# EAGLE design RemoteBoard (EAGLE 9.4.2)
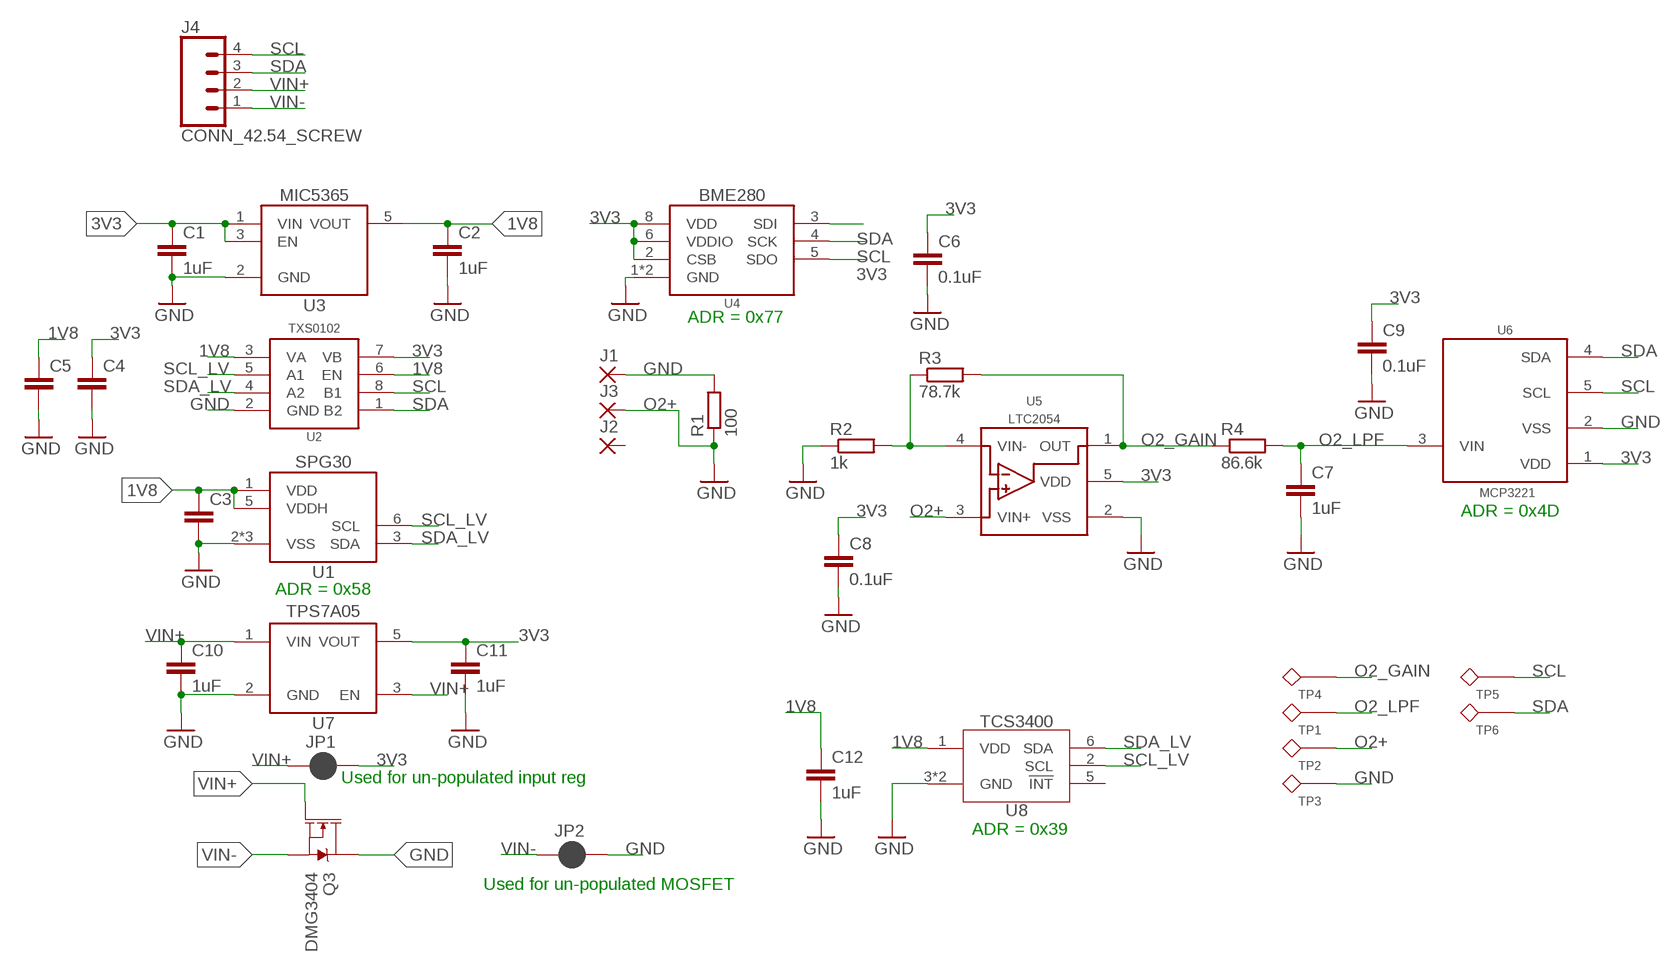
[diagram p0: schematic, sheet 1]

## Parts
C1  1uF  C-EUC0805  [C0805]
C2  1uF  C-EUC0805  [C0805]
C3  C-EUC0805  [C0805]
C4  C-EUC0805  [C0805]
C5  C-EUC0805  [C0805]
C6  0.1uF  C-EUC0805  [C0805]
C7  1uF  C-EUC0805  [C0805]
C8  0.1uF  C-EUC0805  [C0805]
C9  0.1uF  C-EUC0805  [C0805]
C10  1uF  C-EUC0805  [C0805]
C11  1uF  C-EUC0805  [C0805]
C12  1uF  C-EUC0805  [C0805]
J1  SOCKETS9111_SLOT  [SOCKET_S9111-45R_SLOT]
J2  SOCKETS9111_SLOT  [SOCKET_S9111-45R_SLOT]
J3  SOCKETS9111_SLOT  [SOCKET_S9111-45R_SLOT]
J4  CONN_42.54_SCREW  [1X04_SCREW]
JP1  JUMPER-SMT_2_NC_PASTE_SILK  [SMT-JUMPER_2_NC_PASTE_SILK]
JP2  JUMPER-SMT_2_NC_PASTE_SILK  [SMT-JUMPER_2_NC_PASTE_SILK]
Q3  DMG3404  MOSFET-NCH-DMG3404L  [SOT23-3]
R1  100  R-EU_R0805  [R0805]
R2  1k  R-EU_R0805  [R0805]
R3  78.7k  R-EU_R0805  [R0805]
R4  86.6k  R-EU_R0805  [R0805]
TP1  TESTPOINTRCU  [TESTPOINT_0603]
TP2  TESTPOINTRCU  [TESTPOINT_0603]
TP3  TESTPOINTRCU  [TESTPOINT_0603]
TP4  TESTPOINTRCU  [TESTPOINT_0603]
TP5  TESTPOINTRCU  [TESTPOINT_0603]
TP6  TESTPOINTRCU  [TESTPOINT_0603]
U1  SPG30  [DFN_6_2.5X2.5]
U2  TXS0102DCU  [DCU_(R-PDSO-G8)]
U3  MIC53651.8SC70  [DCK_R-PDSO-G5]
U4  BME280  [BME280]
U5  LTC2054  [SOT23-5]
U6  MCP3221  [SOT23-5]
U7  TPS7A0533DBV  [SOT23-5]
U8  TCS3400  [TCS3400]

## Nets
1V8: C2.1 C3.1 C5.1 C12.1 U1.1(VDD) U1.5(VDDH) U2.3(VA) U2.6(EN) U3.5(VOUT) U8.1(VDD)
3V3: C1.1 C4.1 C6.1 C8.1 C9.1 C11.1 JP1.2 U2.7(VB) U3.1(VIN) U3.3(EN) U4.2(CSB) U4.5(SDO) U4.6(VDDIO) U4.8(VDD) U5.5(VDD) U6.1(VDD) U7.5(VOUT)
GND: C1.2 C2.2 C3.2 C4.2 C5.2 C6.2 C7.2 C8.2 C9.2 C10.2 C11.2 C12.2 J1.PAD(P) JP2.2 Q3.3(D) R1.2 R2.1 TP3.1 U1.2(VSS) U1.4(VSS) U1.EP(VSS) U2.2(GND) U3.2(GND) U4.1(GND) U4.7(GND) U5.2(VSS) U6.2(VSS) U7.2(GND) U8.3(GND) U8.4(GND)
N$1: R2.2 R3.1 U5.4(VIN-)
O2+: J3.PAD(P) R1.1 TP2.1 U5.3(VIN+) ; supply symbol labelled GND
O2_GAIN: R3.2 R4.1 TP4.1 U5.1(OUT)
O2_LPF: C7.1 R4.2 TP1.1 U6.3(VIN)
SCL: J4.4 TP5.1 U2.8(B1) U4.4(SCK) U6.5(SCL)
SCL_LV: U1.6(SCL) U2.5(A1) U8.2(SCL)
SDA: J4.3 TP6.1 U2.1(B2) U4.3(SDI) U6.4(SDA)
SDA_LV: U1.3(SDA) U2.4(A2) U8.6(SDA)
VIN+: C10.1 J4.2 JP1.1 Q3.1(G) U7.1(VIN) U7.3(EN)
VIN-: J4.1 JP2.1 Q3.2(S)
Unconnected: J2.PAD(P) U8.5(!INT)

## Notes on the sheet
- ADR = 0x77
- ADR = 0x4D
- ADR = 0x58
- Used for un-populated input reg
- ADR = 0x39
- Used for un-populated MOSFET

## Library data of the parts
C1-C8 = bschulz:C-EU: CAPACITOR, European symbol
C9-C12 = bschulz_passives:C-EU: CAPACITOR, European symbol
J1-J3 = bschulz:SOCKET: Generic Board Socket
J4 = bschulz:CONN_4: Genaric 4 terminal header Digikey 2.54_SCREW <https://www.digikey.com/product-detail/en/on-shore-technology-inc/OSTVN04A150/ED10563-ND/1588864>; DIGIKEY: ED10563-ND; MF: On Shore; MPN: OSTVN04A150
JP1 JP2 = SparkFun-Jumpers:JUMPER-SMT_2_NC_PASTE: Normally closed solder jumper This jumper has an aperture in the stencil to allow solder paste to bridge the split in the wire so it's normally closed (NC). Wick off the solder to open the connection. Reapply solder to reclose the connection.
Q3 = bschulz:MOSFET-NCH: N-channel MOSFETs Voltage controlled devices that allow control of high current outputs. SparkFun Products: SparkFun OpenScale <https://www.sparkfun.com/products/13261> SparkFun Digital Sandbox <https://www.sparkfun.com/products/12651> SparkFun Monster Moto Shield <https://www.sparkfun.com/products/10182> SparkFun MOSFET Power Controller <https://www.sparkfun.com/products/11214>; DIGIKEY: DMG3404L-7DICT-ND; MF: Diodes Incorporated; MPN: DMG3404L-7
R1-R4 = bschulz_passives:R-EU_: RESISTOR, European symbol Digikey Parts: Yageo, 0402 <https://www.digikey.com/products/en/resistors/chip-resistor-surface-mount/52?k=&pkeyword=&sf=0&FV=ffec1104%2Cfffc000d%2C1c0002%2C440067%2C1f140000%2Cffe00034%2C400004&quantity=&ColumnSort=0&page=1&stock=1&pageSize=25> Yageo, 0603 <https://www.digikey.com/products/en/resistors/chip-resistor-surface-mount/52?k=&pkeyword=&s=4356&s=47360&sf=0&FV=fffc000d%2C1c0002%2C142c040c%2C1f140000%2Cffe00034&quantity=10&ColumnSort=1000011&page=1&stock=1&pageSize=25> Panasonic, 0603 <https://www.digikey.com/products/en/resistors/chip-resistor-surface-mount/52?k=&pkeyword=&pv252=68&sf=0&FV=ffec373d%2C1c0002%2C142c040c%2C1f140000%2Cffe00034%2C80002%2Cc0001&quantity=&ColumnSort=0&page=1&stock=1&pageSize=25> Panasonic, precision, 0603 <https://www.digikey.com/products/en/resistors/chip-resistor-surface-mount/52?FV=ffec4907%2Cfffc000a%2Cc0172%2C142c040c%2C1f140000%2Cffe00034%2C1c0002&quantity=100&ColumnSort=2085&page=1&stock=1&pageSize=25> Panasonic, 0805 <https://www.digikey.com/products/en/resistors/chip-resistor-surface-mount/52?k=&pkeyword=&pv3=1&sf=0&FV=ffec373d%2C1c0002%2C1f140000%2Cffe00034%2C142c040d&quantity=&ColumnSort=0&page=1&stock=1&pageSize=25> Rohm, current sense <https://www.digikey.com/products/en/resistors/chip-resistor-surface-mount/52?k=&pkeyword=&pv3=1&sf=0&FV=ffecb688%2C1f140000%2Cffe00034%2C1c0002&quantity=&ColumnSort=0&page=1&stock=1&pageSize=25> Vishay, pulse proof automotive <https://www.digikey.com/products/en/resistors/chip-resistor-surface-mount/52?k=&pkeyword=&pv7=2&sf=0&FV=ffec5d6b%2Cffe00034%2C1f140000&quantity=&ColumnSort=0&page=1&stock=1&pageSize=25>
TP1-TP6 = bschulz:TESTPOINT; DIGIKEY: A106145CT-ND; MF: TE Connectivity; MPN: RCU-0C
U1 = bschulz:SPG30: SGP30 - Multi-pixel Gas Sensor (TVOC, CO2EQ) Characteristics: Vcc: 1.8V Gas Sensing: Ethanol, H2, TVOC, CO2eq Sample Rate: 1Hz (Air Quality), 40Hz (Gas) Operating Temperature: -40°C to 85°C Digikey: 1649-1084-1-ND <https://www.digikey.com/product-detail/en/sensirion-ag/SGP30-2.5K/1649-1084-1-ND/7400967>; DIGIKEY: 1649-1084-1-ND; MF: Sensirion; MPN: SGP30-2.5K
U2 = bschulz:TXS0102: TXS0102 - 2 Channel Bidirectional Voltage Level Translator Characteristics: Vcc: 1.65 ~ 3.6V (Port A), 2.3 ~ 5.5V (Port B) IQ: 14.4μA Output Current: 50mA Output Type: Open Drain/Push-Pull Operating Temperature: -40°C to 85°C Digikey: 296-28368-1-ND (DQE) <https://www.digikey.com/product-detail/en/texas-instruments/TXS0102DQER/296-28368-1-ND/2625893> 296-28435-1-ND (DQM) <https://www.digikey.com/product-detail/en/texas-instruments/TXS0102DQMR/296-28435-1-ND/2638910> 296-21931-1-ND (DCU) <https://www.digikey.com/product-detail/en/texas-instruments/TXS0102DCUR/296-21931-1-ND/1629284>; DIGIKEY: 296-21931-1-ND; MF: TI; MPN: TXS0102DCUR
U3 = bschulz:MIC5365: MIC5365-* - Low Power, High Performance, Linear Regulator Characteristics: Vin: 2.5V ~ 5.5V Vout: Many options, (1v ~ 3.3v) see datasheet <http://ww1.microchip.com/downloads/en/DeviceDoc/mic5365.pdf> IQ: 29μA typ Dropout Voltage: 55mV @ 50mA, input ≥ 2.8v Voltage Accuracy: 2% typ Output Current: 150 mA Operating Temperature: -40°C to 125°C Mouser: MIC5365-3.3YC5 (3.3V Fixed) <https://www.digikey.com/product-detail/en/microchip-technology/MIC5365-3.3YC5-TR/576-3193-1-ND/1868230> MIC5365-1.8YC5 (1.8V Fixed) <https://www.digikey.com/products/en/integrated-circuits-ics/pmic-voltage-regulators-linear/699?k=mic5365&k=&pkeyword=mic5365&sv=0&pv1291=881&sf=0&FV=1c0002%2C1f140000%2Cffe002bb%2C1bcc0020&quantity=&ColumnSort=0&page=1&stock=1&pageSize=25>; DIGIKEY: 576-3181-1-ND; MF: Microchip; MPN: MIC5365-1.8YC5-TR
U4 = bschulz:BME280: BME280 - Combined Digital Humidity and Pressure Sensor Characteristics: Vcc: 1.8V ~ 3.3V Pressure Range: 300 ~ 1100 mBar Pressure Resolution: 0.0015 mBar, max Pressure Accuracy: relative ±0.12 mBar, abs ± 1 mBar Humidity Resolution: 0.008% RH, max Humidity Accuracy: ±3% RH Temperature Resolution: 0.01°C Temperature Accuracy: 0.5°C Operating Temperature: -40°C to 85°C Digikey: 828-1063-1-ND <https://www.digikey.com/product-detail/en/bosch-sensortec/BME280/828-1063-1-ND/6136314>; DIGIKEY: 828-1063-1-ND; DISP: BME280; MF: Bosch; MPN: BME280
U5 = bschulz:LTC2054: LTC2054 -Single Micropower Zero Drift Op-Amp Characteristics: Vs: 2.7 ~ 6V (2.7 ~ +/- 5.5V for LTC2054HV) Iq: 175uA GBP: 500kHz PSSR: 130dB CMMR: 130dB Operating Temperature: -40°C to 85°C Digikey: LTC2054CS5#TRPBFCT-ND <https://www.digikey.com/scripts/DkSearch/dksus.dll?Detail&itemSeq=258611552&uq=636603257096973101> LTC2054HVIS5#TRMPBFCT-ND (High Voltage Variant) <https://www.digikey.com/product-detail/en/linear-technology-analog-devices/LTC2054HVIS5-TRMPBF/LTC2054HVIS5-TRMPBFCT-ND/3830416>; DIGIKEY: LTC2054HS5#TRMPBFCT-ND; DISP: LTC2054; MF: LT; MPN: LTC2054HS5#TRMPBF
U6 = bschulz:MCP3221: MCP342* - SAR ADC Characteristics: VCC: 2.7~5.5V Operating Temperature: -40°C to 125°C Number of Inputs: 1 Sample Rate: 22.3k Samples Per Second Number of Bits: 12 Digikey: MCP3221A5T-I/OTCT-ND <https://www.digikey.com/product-detail/en/microchip-technology/MCP3221A5T-I-OT/MCP3221A5T-I-OTCT-ND/529836>; DIGIKEY: MCP3221A5T-I/OTCT-ND; DISP: MCP3221; MF: TI; MPN: MCP3221A5T-I/OT
U7 = bschulz:TPS7A05*: TPS7A05* - Ultra Low Power Low Dropout Linear Regulator Characteristics: Vin: 1.4V ~ 5.5V Vout: 0.8, 1.0, 1.2, 1.5, 1.8, 2.5, 2.85, 3.3V fixed IQ: 1μA typ, 3μA max Voltage Accuracy: 1% typ, 3% max Output Current: 200 mA Operating Temperature: -40°C to 125°C Mouser: TPS7A0533 (3.3V Fixed) <https://www.mouser.com/ProductDetail/Texas-Instruments/TPS7A0533PDBVR?qs=sGAEpiMZZMsGz1a6aV8DcD1rpA6FsR3J1Mp5DdTpiXw%3d> TPS7A0518 (1.8V Fixed) <https://www.mouser.com/ProductDetail/Texas-Instruments/TPS7A0518PDBVR?qs=sGAEpiMZZMsGz1a6aV8DcD1rpA6FsR3J1f7DNYacdSI%3d>; DIGIKEY: 296-50256-1-ND; MF: TI; MOUSER: 595-TPS7A0533PDBVR; MPN: TPS7A0533PDBVR
U8 = bschulz:TCS3400: TCS3400 - Ambient Multi-Band Light Sensor with I2C Interface Characteristics: VCC: 2.7~3.6V Operating Temperature: -40°C to 70°C Digikey: TCS34003FNMCT-ND <https://www.digikey.com/products/en/sensors-transducers/optical-sensors-ambient-light-ir-uv-sensors/536?k=tcs3400&k=&pkeyword=tcs3400&sv=0&pv7=2&sf=0&FV=-8%7C536%2C1989%7C0&quantity=&ColumnSort=0&page=1&stock=1&pageSize=25>; DIGIKEY: TCS34003FNMCT-ND; MF: AMS; MPN: TCS34003FNM

## Board
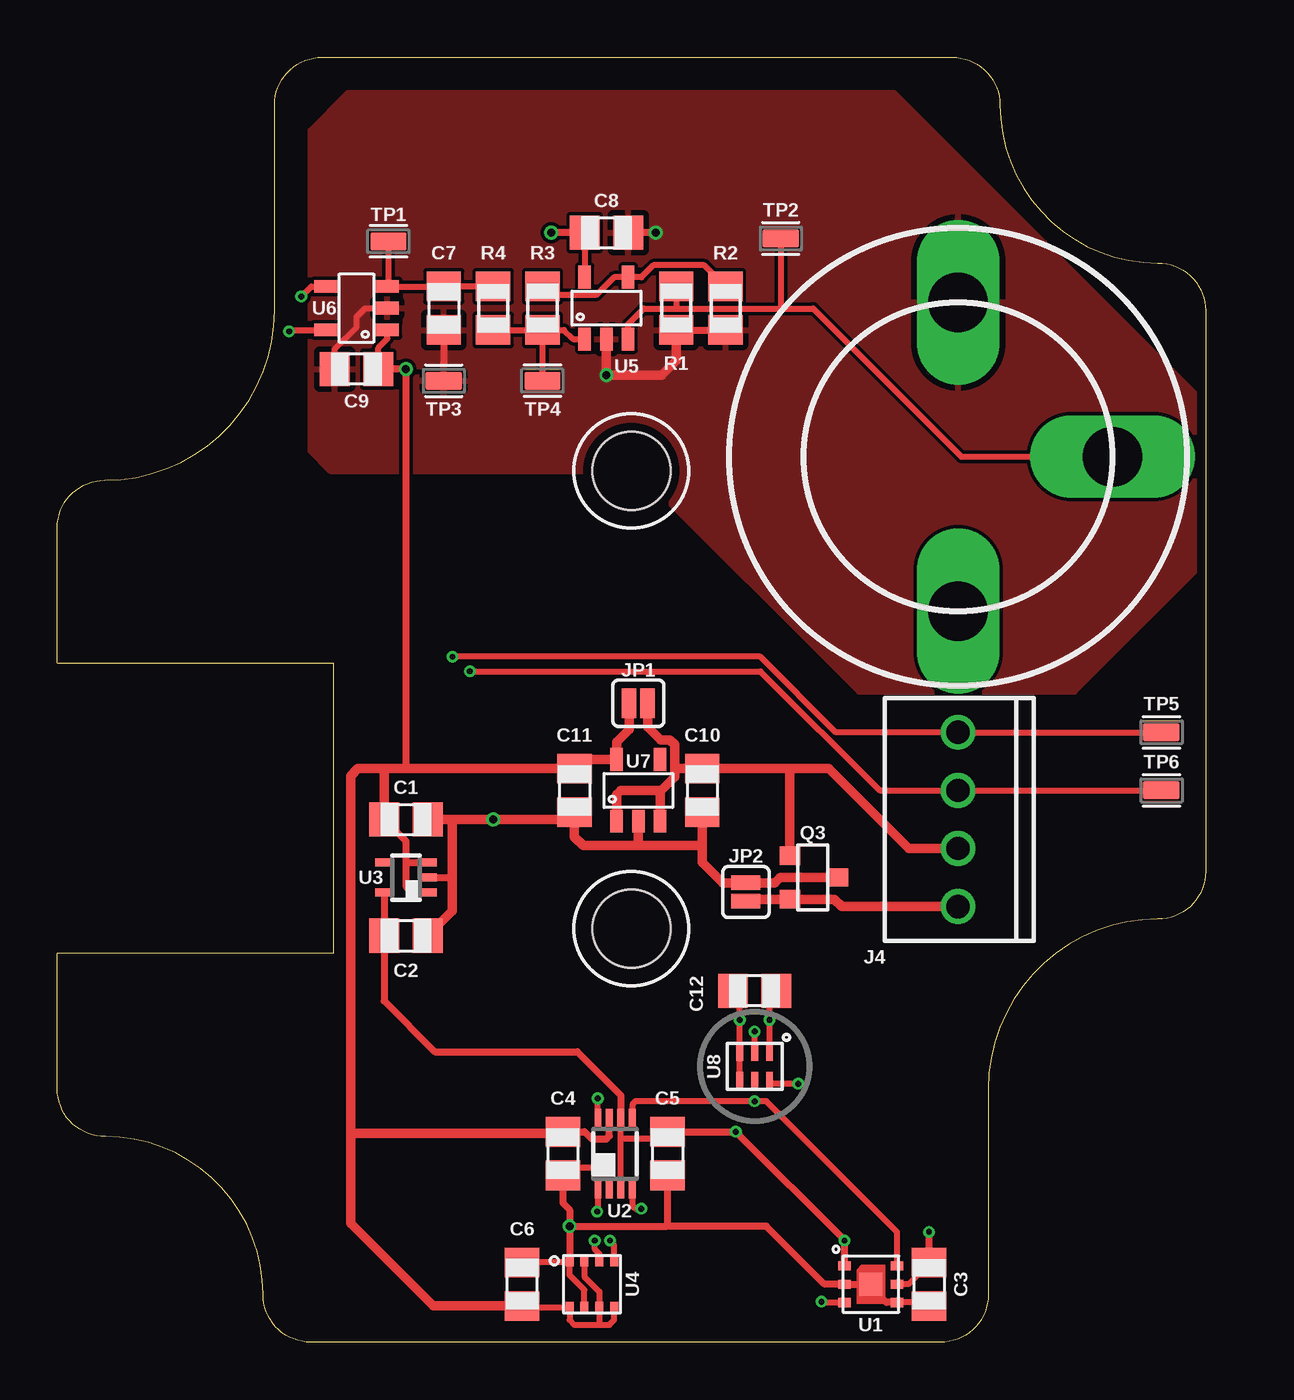
[diagram p1: board, top side]
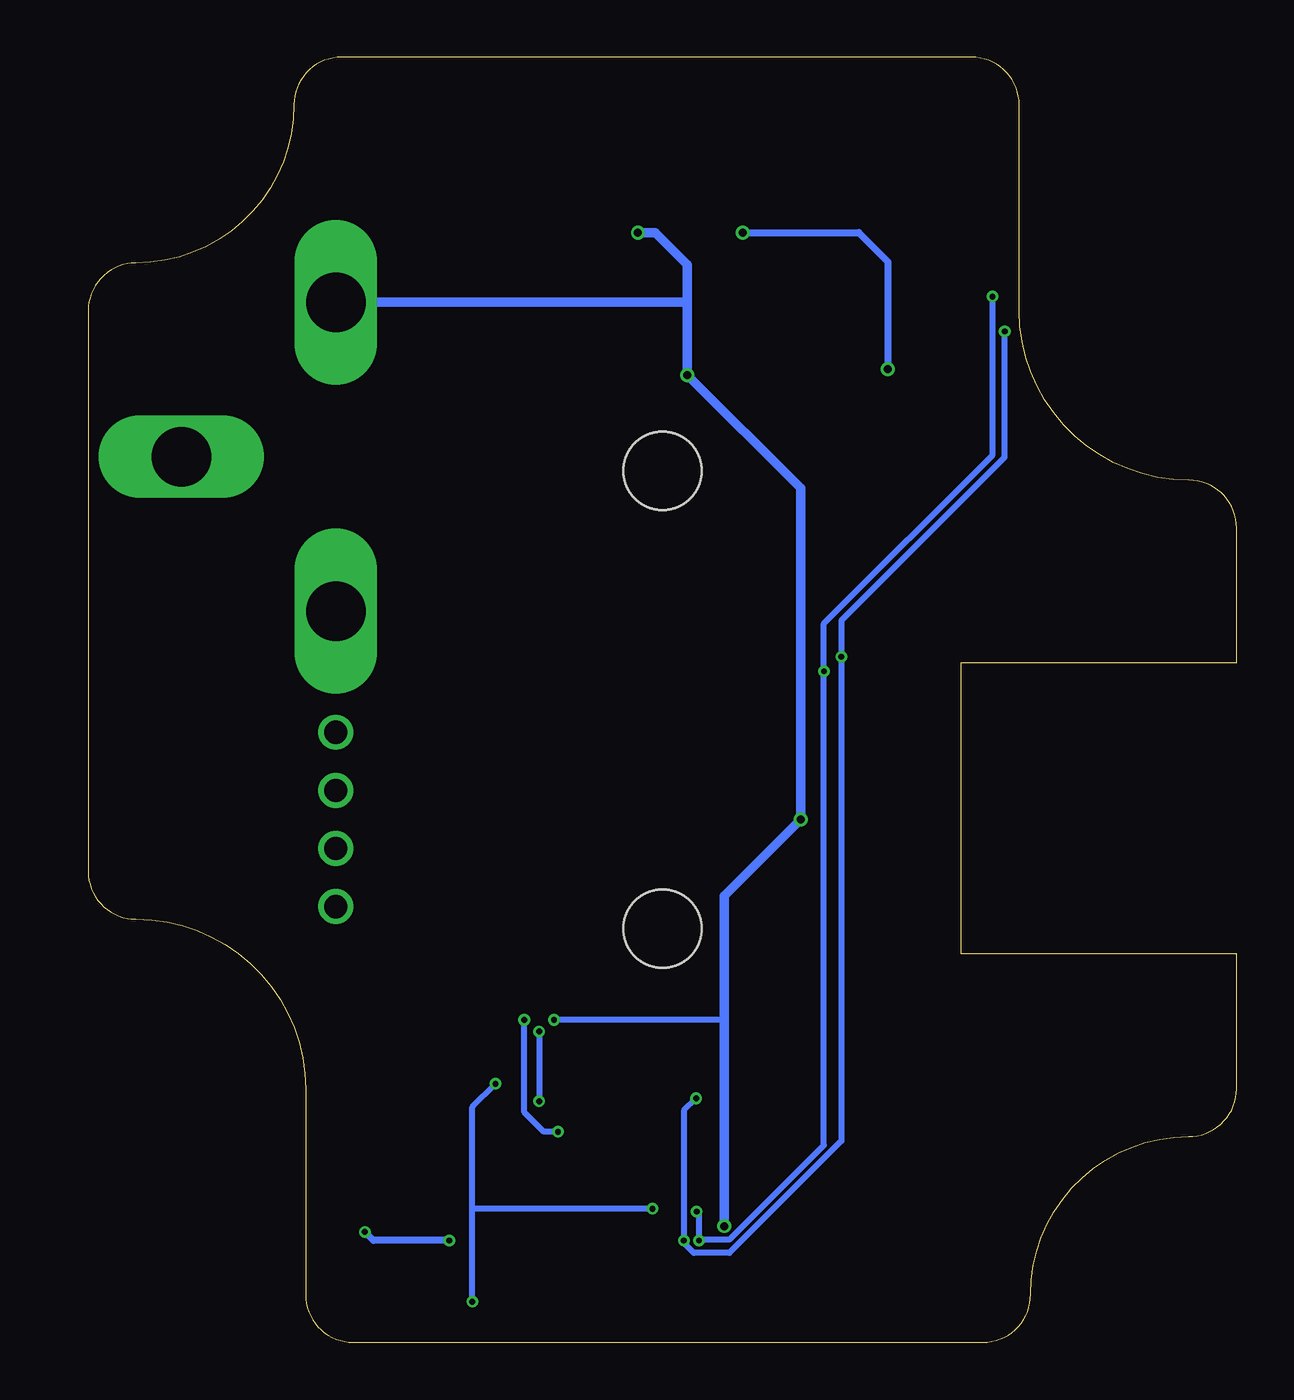
[diagram p2: board, bottom side, seen from below]

Size 50.19 x 56.18 mm. Coordinates in mm from the lower left corner, seen from the top.
Outline: 38.61,0 11.08,0 arc-90 9,2.1 arc90 2.1,9 arc-90 0,11.08 0,16.99 12.06,16.99 12.06,29.69 0,29.69 0,35.61 arc-90 2.08,37.69 arc90 9.5,45.11 9.5,54.1 arc-90 11.58,56.19 39.12,56.19 arc-90 41.2,54.1 arc90 48.11,47.19 arc-90 50.19,45.1 50.19,20.58 arc-90 48.11,18.5 arc90 40.69,11.08 40.69,2.08 arc-90 38.61,0
Copper layers (1*16): Top 0.035559375mm / dielectric 1.6mm / Bottom 0.035559375mm
Design rules "oshpark-2layer *": minimum track width 6mil, minimum drill 10mil, track to track 6mil, track to pad 6mil, pad to pad 6mil, via to via 6mil, smd to smd 6mil, copper to edge 15mil, drill to drill 6mil, minimum pad ring 5mil, minimum via ring 5mil, stop-mask expansion 2.5mil, vias tented up to drill 0mil, thermal gap 10mil
Holes 3.43 mm at 25.1,18.08 25.1,38.1

### Footprints (pad centres in the part's own frame; a part is rotated, then mirrored left to right if it is on the bottom)
C0805 = smd 1.3 x 1.5: 1 -0.95,0; 2 0.95,0
SOCKET_S9111-45R_SLOT = drill 2.6 pad 3 long: PAD 0,0
1X04_SCREW = drill 1.016: 1 -3.81,0; 2 -1.27,0; 3 1.27,0; 4 3.81,0
SMT-JUMPER_2_NC_PASTE_SILK = smd 0.635 x 1.27: 1 -0.406,0; 2 0.406,0
SOT23-3 = smd 0.8 x 0.9: 1 -0.95,-1; 2 0.95,-1; 3 0,1.1
R0805 = smd 1.3 x 1.5: 1 -0.95,0; 2 0.95,0
TESTPOINT_0603 = smd 1.6 x 0.8: 1 0,0
DFN_6_2.5X2.5 = smd 0.55 x 0.4: 1 -1.15,0.8; 2 -1.15,0; 3 -1.15,-0.8; 4 1.15,-0.8; 5 1.15,0; 6 1.15,0.8 | smd 1 x 1: EP 0,0
DCU_(R-PDSO-G8) = smd 0.3 x 0.8: 1 -0.75,-1.55; 2 -0.25,-1.55; 3 0.25,-1.55; 4 0.75,-1.55; 5 0.75,1.55; 6 0.25,1.55; 7 -0.25,1.55; 8 -0.75,1.55
DCK_R-PDSO-G5 = smd 0.35 x 0.8: 1 -0.65,-0.95; 2 0,-0.95; 3 0.65,-0.95; 4 0.65,0.95; 5 -0.65,0.95
BME280 = smd 0.5 x 0.35: 1 1.025,0.975; 2 1.025,0.325; 3 1.025,-0.325; 4 1.025,-0.975; 5 -1.025,-0.975; 6 -1.025,-0.325; 7 -1.025,0.325; 8 -1.025,0.975
SOT23-5 = smd 0.55 x 1: 1 -0.95,-1.35; 2 0,-1.35; 3 0.95,-1.35; 4 0.95,1.35; 5 -0.95,1.35
TCS3400 = smd 0.75 x 0.3: 1 -0.625,0.65; 2 -0.625,0; 3 -0.625,-0.65; 4 0.625,-0.65; 5 0.625,0; 6 0.625,0.65

### Placement (x,y rotation side)
C1  15.24,22.86 0 top
C2  15.24,17.78 0 top
C3  0.1uF  [C0805]  38.1,2.54 270 top
C4  0.1uF  [C0805]  22.1,8.26 270 top
C5  0.1uF  [C0805]  26.67,8.26 270 top
C6  20.32,2.54 90 top
C7  16.89,45.21 270 top
C8  24,48.51 0 top
C9  13.08,42.55 180 top
C10  28.19,24.13 270 top
C11  22.61,24.13 270 top
C12  30.48,15.37 180 top
J1  39.37,45.47 180 top
J2  39.37,31.97 180 top
J3  46.12,38.72 90 top
J4  39.37,22.86 90 top
JP1  25.4,27.94 180 top
JP2  30.1,19.68 90 top
Q3  33.02,20.32 270 top
R1  27.05,45.21 270 top
R2  29.21,45.21 90 top
R3  21.21,45.21 270 top
R4  19.05,45.21 90 top
TP1  14.48,48.13 180 top
TP2  31.62,48.26 0 top
TP3  16.89,42.04 0 top
TP4  21.21,42.04 180 top
TP5  48.26,26.67 0 top
TP6  48.26,24.13 0 top
U1  35.56,2.54 0 top
U2  24.38,8.26 0 top
U3  15.24,20.32 90 top
U4  23.37,2.54 90 top
U5  24,45.21 0 top
U6  13.08,45.21 90 top
U7  25.4,24.13 0 top
U8  30.48,12.06 270 top

### Tracks (layer width: path | path; a pad name or v marks a point on that pad's centre or on a via)
1V8  (via drill 0.25)
  Top 0.254: C3.1 38.1,3.43 37.21,2.54 U1.5 | U2.3 24.63,8.89 | 24.63,8.89 U2.6 | C5.1 26.36,8.89 24.63,8.89 | U8.1 v31.13,14.1 31.13,15.07 C12.1
  Top 0.305: U3.5 C2.1 14.29,14.92 16.51,12.7 22.73,12.7 24.64,10.79 U2.6 | C5.1 v29.66,9.21 v34.41,4.45 U1.1 | v38.1,4.83 C3.1
  Bottom 0.254: v29.66,9.21 30.28,9.21 31.13,10.06 v31.13,14.1
  Bottom 0.305: v34.41,4.45 37.73,4.45 v38.1,4.83
3V3  (via drill 0.35)
  Top 0.254: C6.1 20.39,1.51 U4.8 22.39,0.97 22.61,0.76 23.75,0.76 | 23.75,0.76 24.13,0.76 24.34,0.97 U4.5 | 23.75,0.76 23.69,0.82 U4.6 23.69,2.21 23.04,2.87 U4.2 | C9.1 14.03,43.48 14.43,43.88 U6.1 | C8.1 U5.5
  Top 0.305: C4.1 23.05,9.21 23.37,8.89 24,8.89 24.13,9.02 U2.7 | C1.1 15.24,21.91 15.24,20.95 | U3.1 15.51,19.67 15.24,19.94 15.24,20.95 | U3.3 16.18,20.95 15.24,20.95 | C8.1 v21.59,48.51 | C9.1 v15.24,42.55 15.24,31.5 15.24,25.08
  Top 0.406: JP1.2 24.99,26.8 24.45,26.25 U7.5 23.01,25.48 C11.1 15.24,25.08 14.35,25.08 | 14.35,25.08 13.14,25.08 12.83,24.77 12.83,9.14 | C1.1 14.29,25.02 14.35,25.08 | C6.1 16.44,1.59 12.83,5.21 12.83,9.14 | C4.1 22.04,9.14 12.83,9.14
  Bottom 0.305: v15.24,42.55 15.24,47.24 16.51,48.51 v21.59,48.51
GND  (via drill 0.25, 0.35)
  Top 0.254: C6.2 22.32,3.49 U4.1 22.39,2.94 23.04,2.29 U4.7 | C3.2 37.95,1.74 U1.4 | C9.2 12.13,43.43 13.08,44.38 13.08,44.83 13.46,45.21 U6.2 | U8.4 U8.3 v29.83,14.1 29.83,15.07 C12.2 | U2.2 24.13,7.24 23.75,7.62 22.41,7.62 C4.2
  Top 0.305: 26.36,7.62 C5.2 26.67,5.08 | C4.2 22.1,6.1 22.39,5.8 v22.39,5.08 | v22.39,5.08 U4.1 | v22.39,5.08 26.67,5.08 | U3.2 17.27,20.32 | 26.67,5.08 30.99,5.08 33.53,2.54 U1.2 U1.EP 35.56,2.41 36.23,1.74 U1.4 | v26.16,48.51 C8.2 | C7.2 16.89,42.8 | R1.2 R2.1
  Top 0.406: 25.4,21.72 22.99,21.72 22.61,22.1 C11.2 22.29,22.86 v19.05,22.86 17.27,22.86 | U7.2 25.4,21.72 | Q3.3 31.6,20.32 31.37,20.09 JP2.2 29.08,20.09 28.19,20.98 28.19,21.72 | C2.2 17.27,18.86 17.27,20.32 17.27,22.86 | 17.27,22.86 C1.2 | 28.19,21.72 C10.2 | 25.4,21.72 28.19,21.72 | U5.2 v24,42.29 26.42,42.29 27.05,42.93 R1.2
  Bottom 0.254: 22.39,13.97 22.52,14.1 v29.83,14.1
  Bottom 0.406: v22.39,5.08 22.39,13.97 22.39,19.52 v19.05,22.86 19.05,37.34 v24,42.29 24,45.47 | 24,45.47 24,47.12 25.4,48.51 v26.16,48.51 | J1.PAD 24,45.47
  pour Top: 12.7,54.61 11.05,52.96 11.05,38.99 11.94,38.1 25.4,38.1 35.05,28.45 44.45,28.45 49.91,33.91 49.91,41.27 36.58,54.61
N$1
  Top 0.254: R2.2 28.28,47.09 26.06,47.09 25.53,46.56 U5.4 24.34,46.56 23.56,45.78 21.59,45.78 R3.1
O2+
  Top 0.254: U5.3 24.95,44.51 25.63,45.19 27.05,45.19 | 27.05,45.19 31.62,45.19 | 31.62,45.19 33.04,45.19 39.52,38.72 J3.PAD | TP2.1 31.62,45.19 | R1.1 27.05,45.19
O2_GAIN
  Top 0.254: R4.1 R3.2 | R3.2 22.14,44.26 22.55,43.86 U5.1 | R3.2 TP4.1
O2_LPF
  Top 0.254: R4.2 C7.1 14.48,46.16 | U6.3 14.48,46.16 | TP1.1 14.48,46.16
SCL  (via drill 0.25)
  Top 0.254: U4.4 24.34,4.26 v24.16,4.45 | v23.62,10.67 23.63,10.66 U2.8 | v10.13,44.2 10.2,44.26 U6.5 | v17.27,29.97 30.73,29.97 34.04,26.67 J4.4 TP5.1
  Bottom 0.254: v23.62,10.67 24.16,10.13 v24.16,4.45 24.16,4.35 23.72,3.91 22.16,3.91 17.27,8.8 v17.27,29.97 17.27,31.55 10.13,38.69 v10.13,44.2
SCL_LV  (via drill 0.25)
  Top 0.254: U1.6 36.71,4.82 30.99,10.54 v30.48,10.54 25.27,10.54 25.13,10.4 U2.5 | U8.2 v30.48,13.59
  Bottom 0.254: v30.48,13.59 v30.48,10.54
SDA  (via drill 0.25)
  Top 0.254: 23.62,6.69 U2.1 23.63,5.71 v23.6,5.71 | U4.3 23.69,3.86 23.5,4.06 v23.5,4.45 | v10.67,45.72 11.11,46.16 U6.4 | v18.03,29.34 30.73,29.34 35.94,24.13 J4.3 TP6.1
  Bottom 0.254: v23.6,5.71 23.5,5.61 v23.5,4.45 23.44,4.5 22.15,4.5 18.03,8.62 v18.03,29.34 18.03,31.43 10.67,38.79 v10.67,45.72
SDA_LV  (via drill 0.25)
  Top 0.254: U2.4 25.13,5.98 25.27,5.84 v25.53,5.84 | v33.4,1.78 33.44,1.74 U1.3 | v32.38,11.3 31.27,11.3 U8.6
  Bottom 0.254: v32.38,11.3 33.4,10.29 33.4,5.84 | v33.4,1.78 33.4,5.84 | v25.53,5.84 33.4,5.84
VIN+
  Top 0.406: U7.1 24.45,23.94 24.64,24.13 26.35,24.13 | JP1.1 25.81,26.9 26.37,26.34 26.77,26.34 26.98,26.13 26.98,25.02 | 26.98,25.02 26.98,24.71 26.41,24.13 26.35,24.13 | 26.98,25.02 27.04,25.08 C10.1 32,25.08 | J4.2 37.21,21.59 33.72,25.08 32,25.08 | Q3.1 32,21.29 32,25.08 | 26.35,24.13 U7.3
VIN-
  Top 0.406: J4.1 34.29,19.05 33.97,19.37 Q3.2 30.19,19.37 JP2.1

### Text on the board
tDocu: SCL | SDA | V+ | V- | To Logger / 3.3v | Project-Palmer / Remote / v0.0 / Bobby Schulz | No / Cover!